# EasyEDA Pro project ProPrj_辉光管时钟V1.0_2025-10-09.epro, schematic 电源+控制部分

## Sheets
1 控制: Create Date: 2024-01-13; Page Name: 控制; Project Name: 辉光管时钟成品; Schematic Name: 电源+控制部分; Update Date: 2024-08-01; Company: 嘉立创EDA; Page Size: A4; Version: V1.0
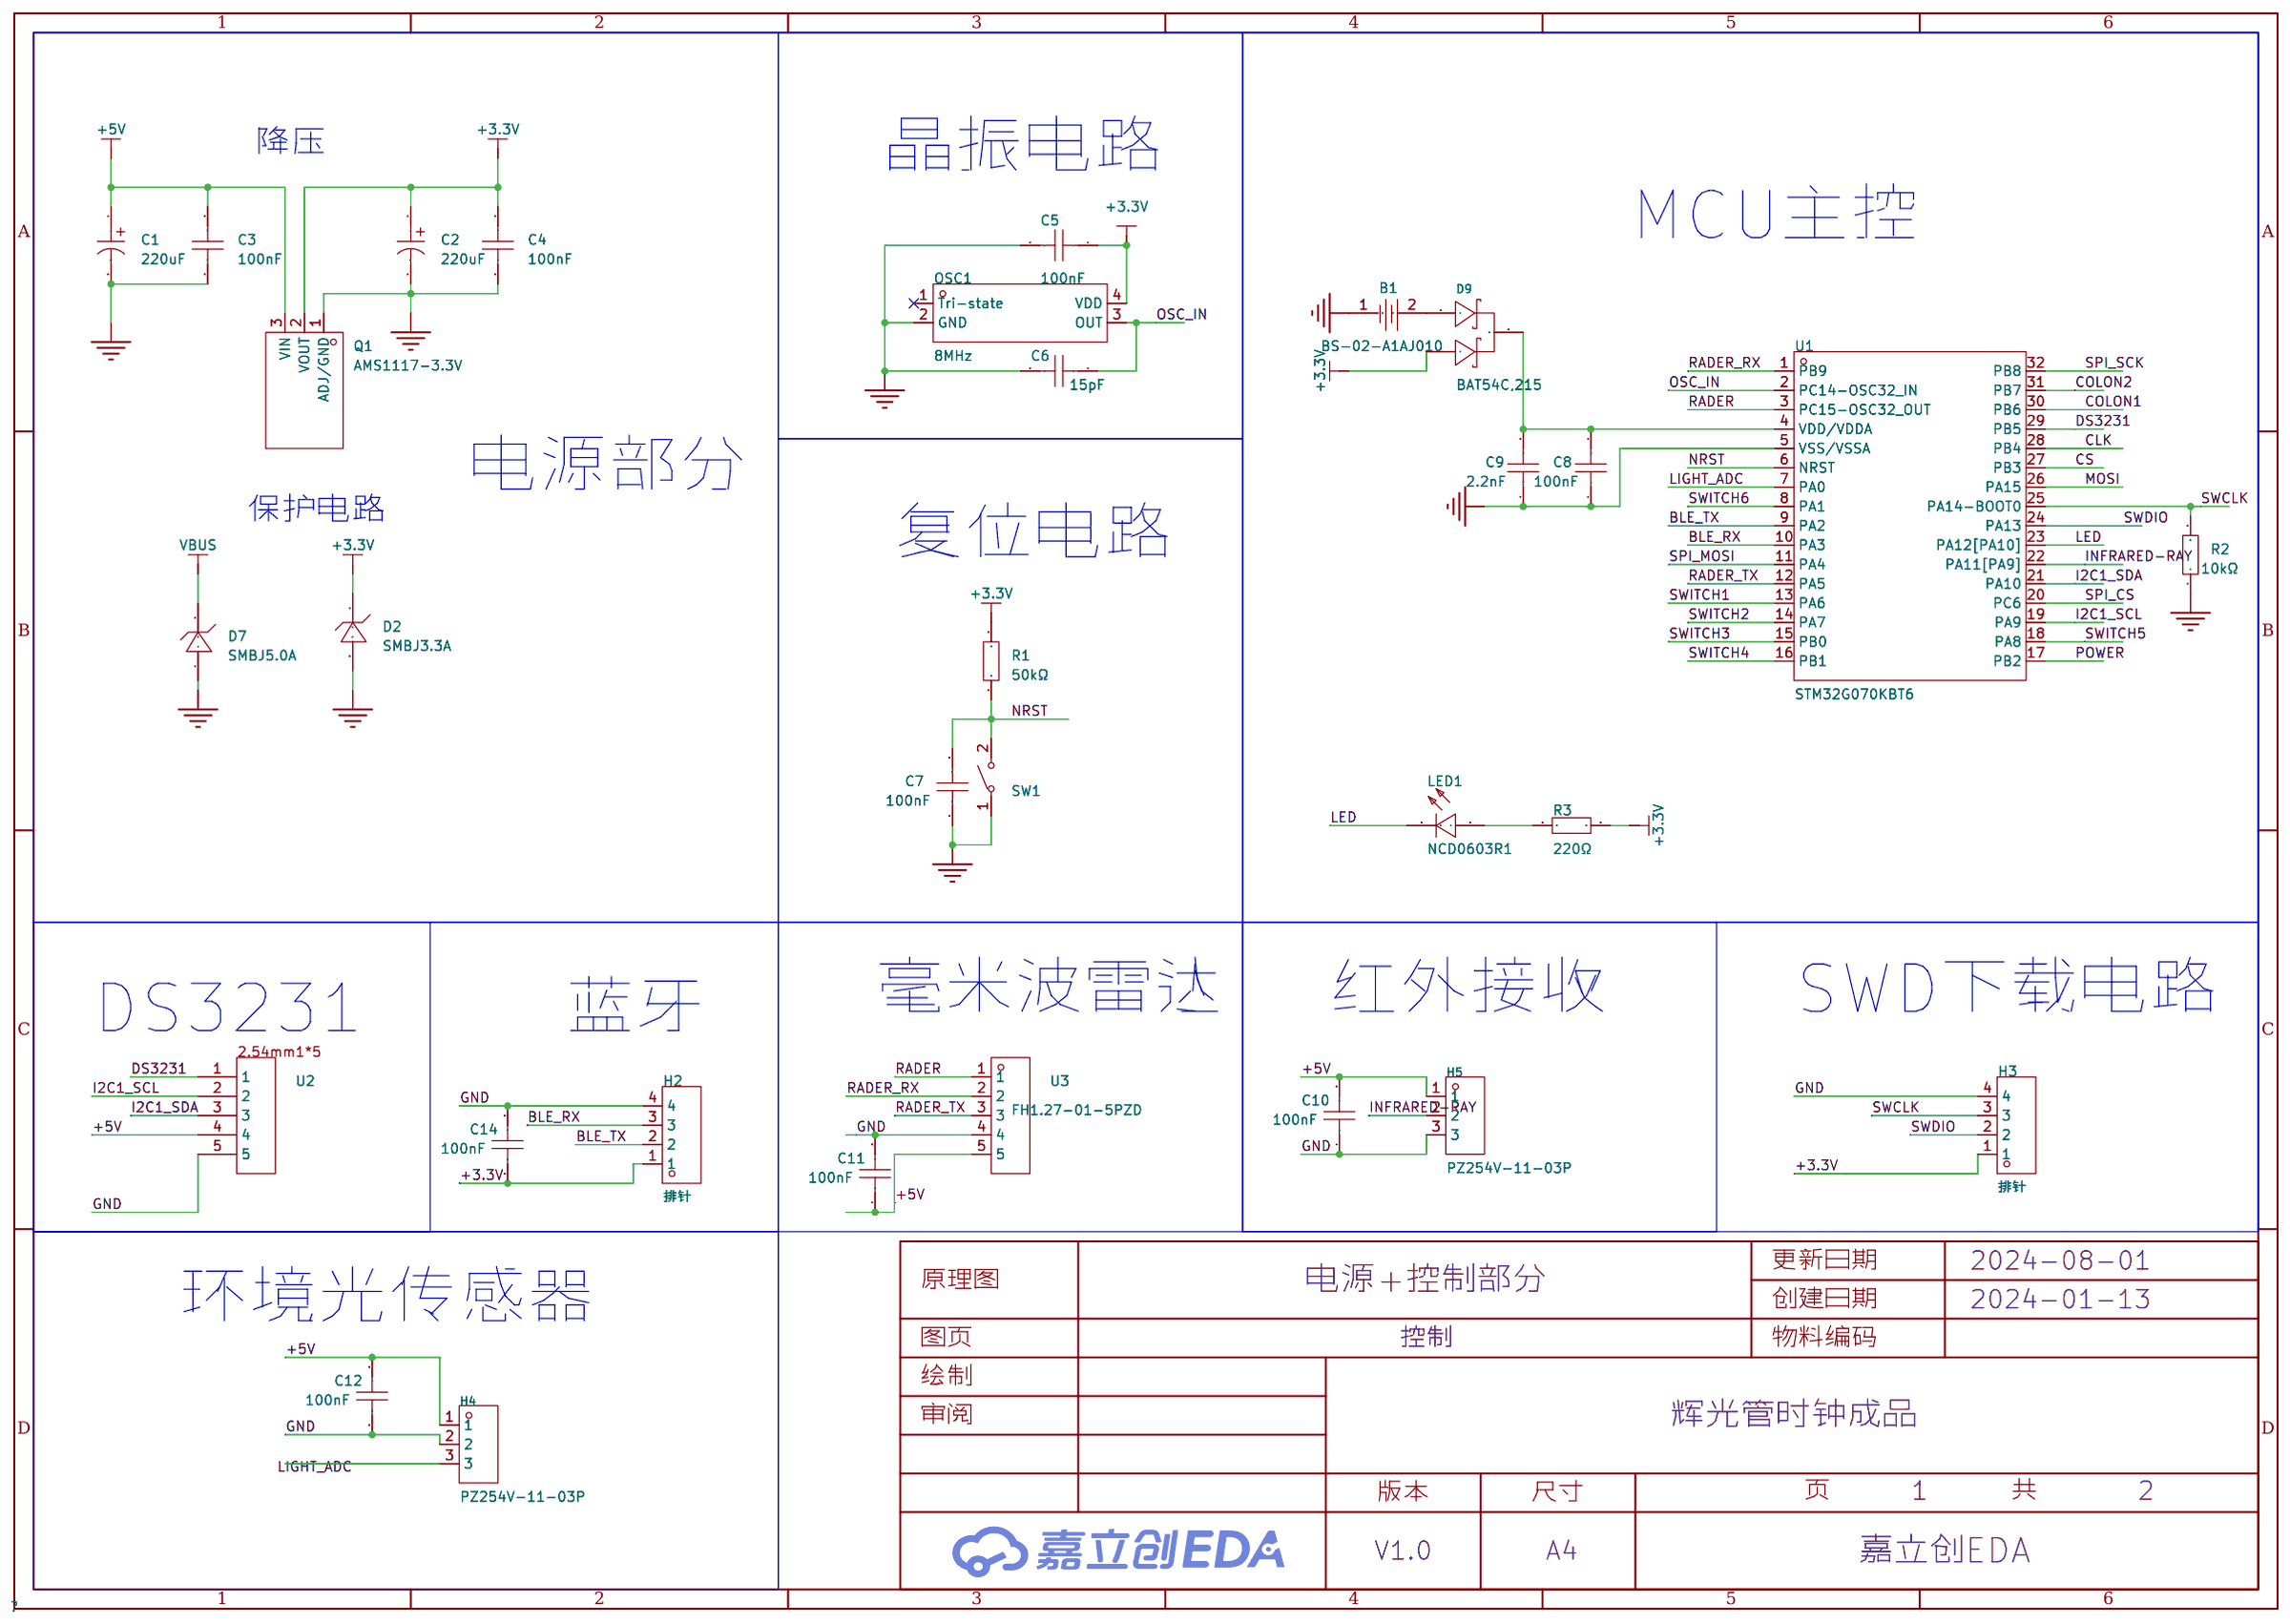
[diagram p1: 控制]
2 电源: Create Date: 2024-01-25; Page Name: 电源; Update Date: 2024-03-15; Page Size: A3
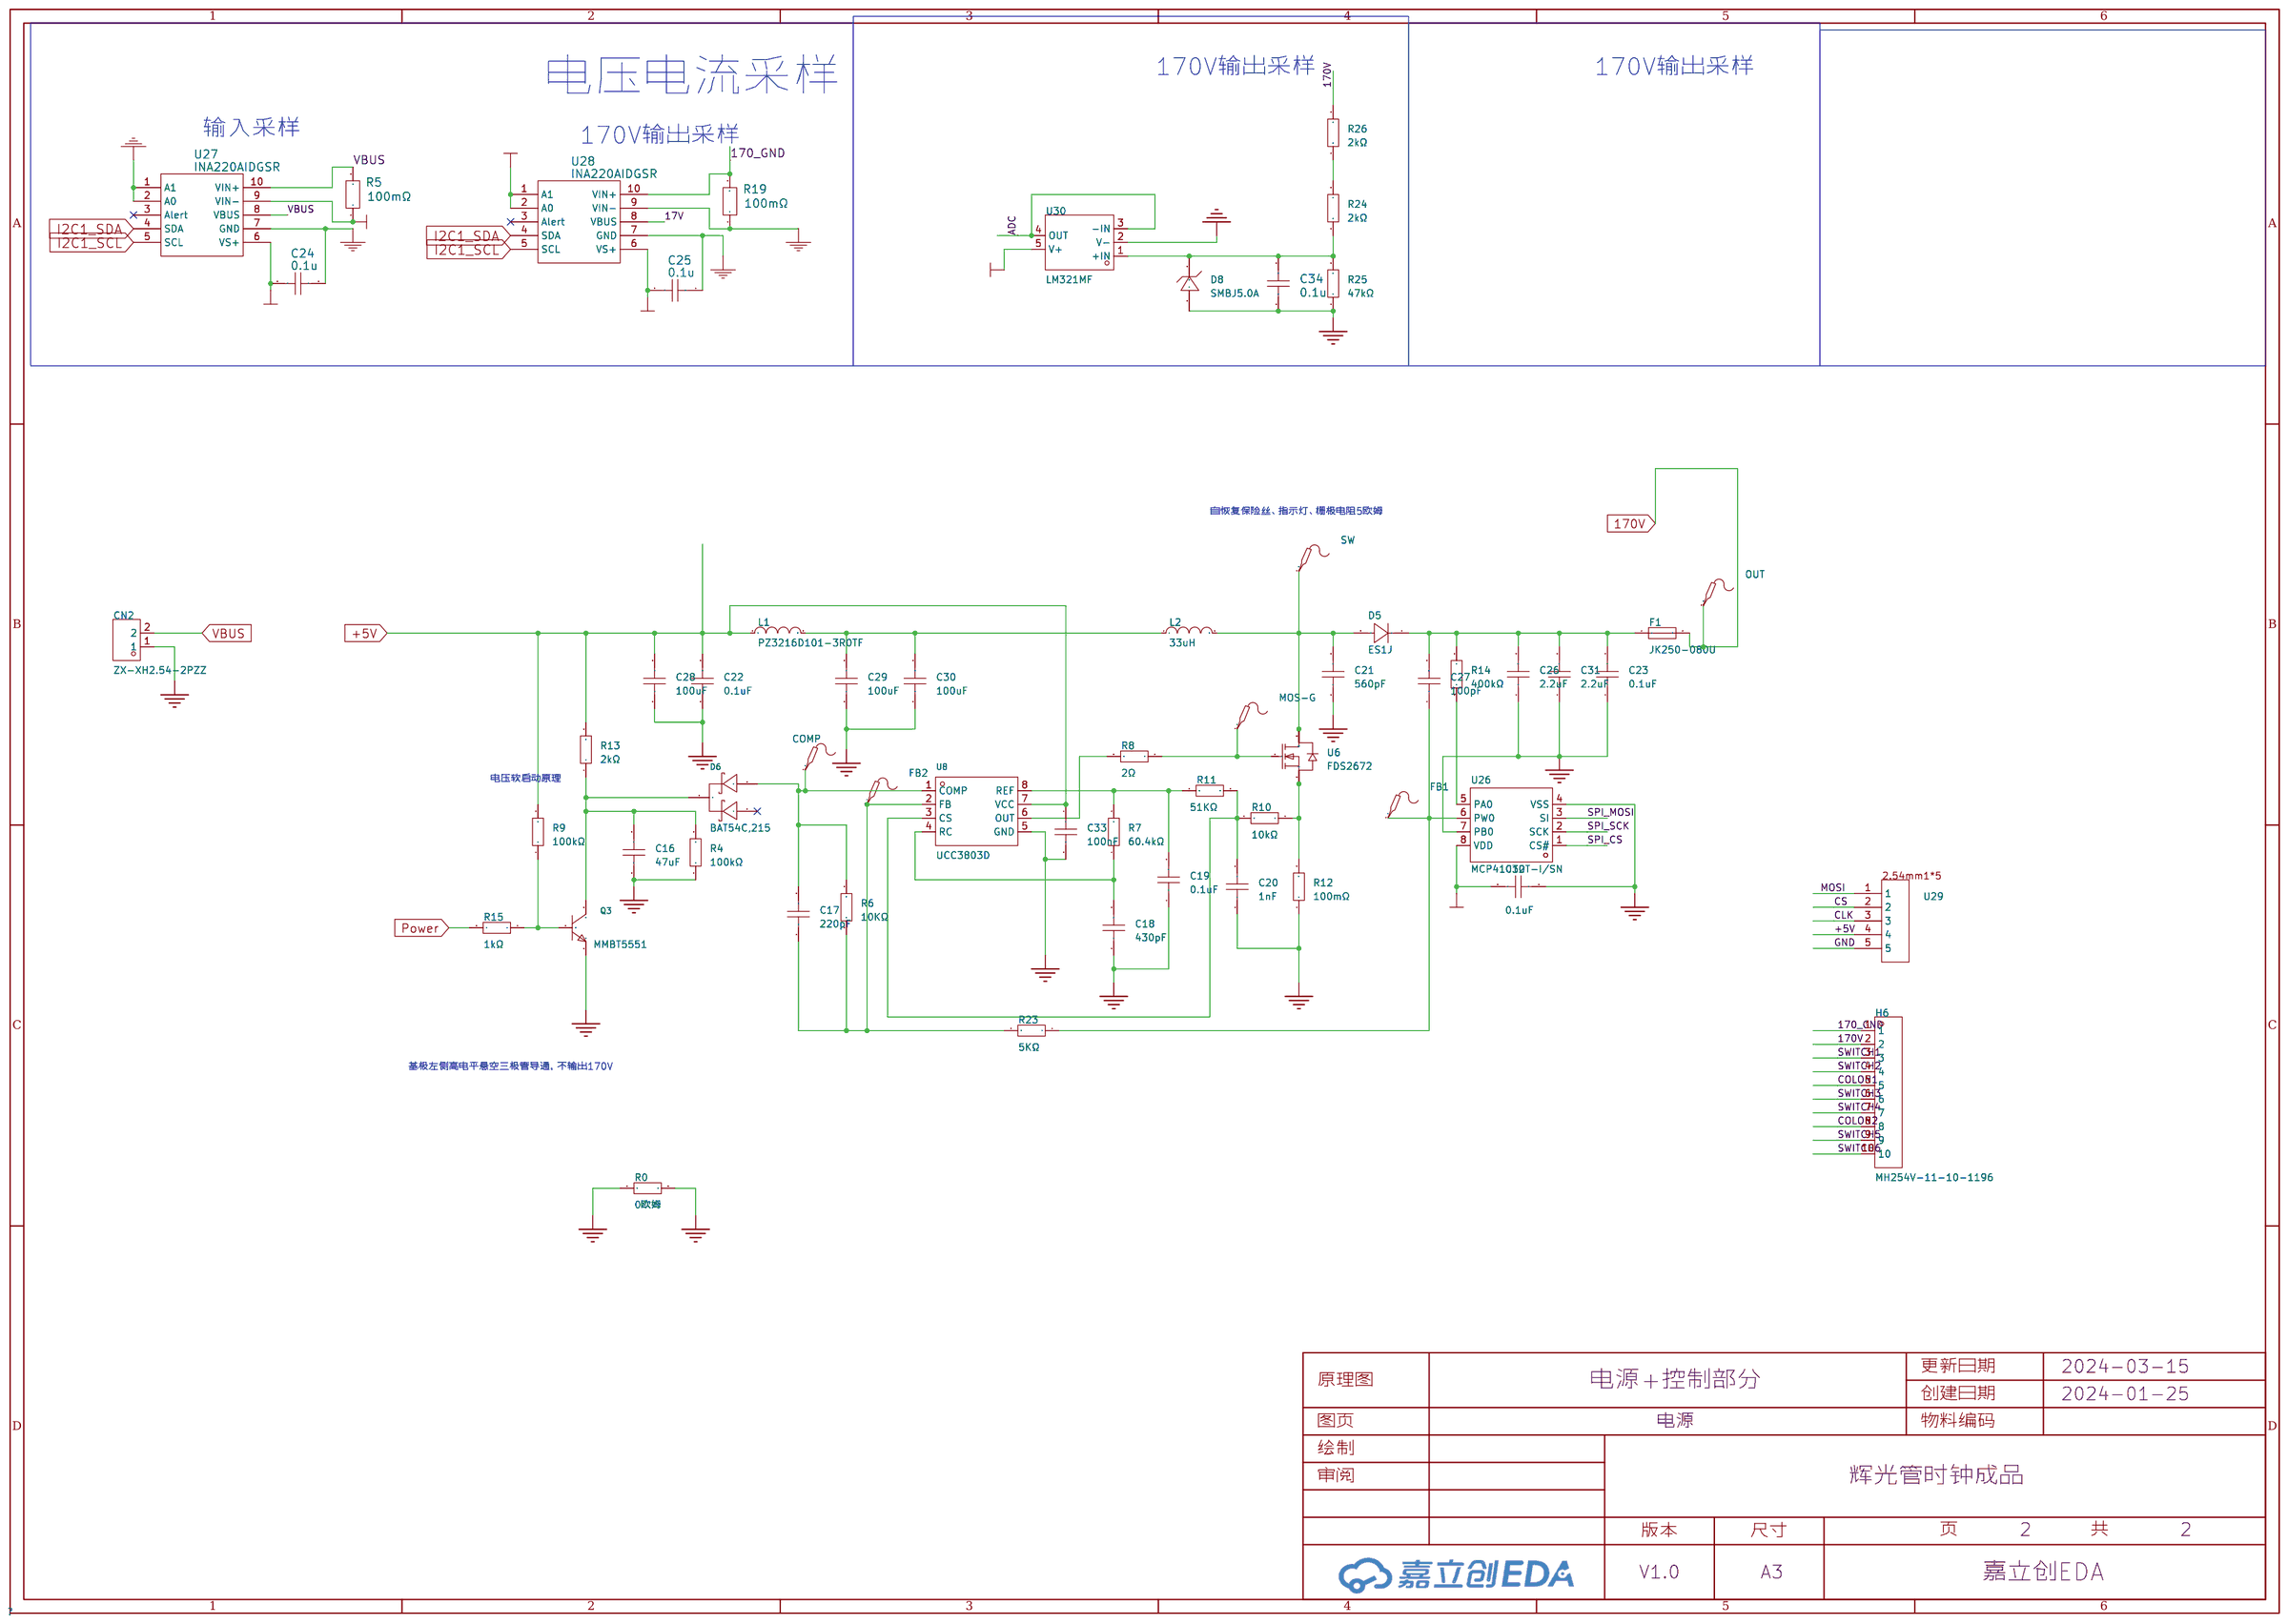
[diagram p2: 电源]

## Parts
sheet 控制
B1  BS-02-A1AJ010  [BAT-TH_BS-02-A1AJ010]
C1  220uF  [CAP-SMD_BD6.3-L6.6-W6.6-FD]
C2  220uF  [CAP-SMD_BD6.3-L6.6-W6.6-FD]
C3  100nF  [C0603]
C4  100nF  [C0603]
C5  100nF  [C0603]
C6  15pF  [C0603]
C7  100nF  [C0603]
C8  100nF  [C0603]
C9  2.2nF  [C0603]
C10  100nF  [C0603]
C11  100nF  [C0603]
C12  100nF  [C0603]
C14  100nF  [C0603]
D2  SMBJ3.3A  [SMB_L4.6-W3.6-LS5.3-RD]
D7  SMBJ5.0A  [SMB_L4.4-W3.6-LS5.3-RD]
D9  BAT54C,215  [SOT-23-3_L2.9-W1.6-P1.90-LS2.8-BR]
H2  排针  [SIP-2.54MM-4P-CJT-H8.54]
H3  排针  [SIP-2.54MM-4P-CJT-H8.54]
H4  PZ254V-11-03P  [HDR-TH_3P-P2.54-V-M]
H5  PZ254V-11-03P  [HDR-TH_3P-P2.54-V-M]
LED1  NCD0603R1  [LED0603-RD_RED]
OSC1  8MHz  [OSC-SMD_4P-L3.2-W2.5-BL-1]
Q1  AMS1117-3.3V  [SOT-89-3_L4.5-W2.5-P1.50-LS4.2-BR]
R1  50kΩ  [r0603]
R2  10kΩ  [r0603]
R3  220Ω  [r0603]
SW1  TS-1088R-02026  [SW-SMD_L3.9-W3.0-P4.45]
U1  STM32G070KBT6  [LQFP-32_L7.0-W7.0-P0.80-LS9.0-BL]
U2  -  [2.54mm1*5]
U3  FH1.27-01-5PZD  [HDR-TH_5P-P1.27-V-M]
sheet 电源
C16  47uF  [C0805]
C17  220pF  [c0603]
C18  430pF  [c0603]
C19  0.1uF  [c0603]
C20  1nF  [c0603]
C21  560pF  [c1206]
C22  0.1uF  [c0603]
C23  0.1uF  [c1206]
C24  0.1u  [C0603]
C25  0.1u  [C0603]
C26  2.2uF  [c1210]
C27  100pF  [C0805]
C28  100uF  [c1206]
C29  100uF  [c1206]
C30  100uF  [c1206]
C31  2.2uF  [c1210]
C32  0.1uF  [c0603]
C33  100nF  [C0603]
C34  0.1u  [C0603]
CN2  ZX-XH2.54-2PZZ  [CONN-TH_2P-P2.50_HX25003-2A]
COMP  -  [Test-Point-0.5mm]
D5  ES1J  [sod-123_l2.7-w1.6-ls3.6-rd]
D6  BAT54C,215  [SOT-23-3_L2.9-W1.6-P1.90-LS2.8-BR]
D8  SMBJ5.0A  [SMB_L4.4-W3.6-LS5.3-RD]
F1  JK250-080U  [FUSE-TH_L5.8-W3.8-P5.10-D0.8]
FB1  -  [Test-Point-0.5mm]
FB2  -  [Test-Point-0.5mm]
H6  MH254V-11-10-1196  [HDR-TH_10P-P2.54-V-M]
L1  10uH  [l0603]
L2  33uH  [33uh功率电感]
MOS-G  -  [Test-Point-0.5mm]
OUT  -  [Test-Point-0.5mm]
Q3  MMBT5551  [SOT-23-3_L2.9-W1.3-P1.90-LS2.4-BR]
R0  0欧姆  [R0603]
R4  100kΩ  [r0603]
R5  100mΩ  [R0805]
R6  10KΩ  [r0603]
R7  60.4kΩ  [r0603]
R8  2Ω  [r0603]
R9  100kΩ  [r0603]
R10  10kΩ  [r0603]
R11  51KΩ  [r0603]
R12  100mΩ  [R0805]
R13  2kΩ  [r0603]
R14  400kΩ  [r0603]
R15  1kΩ  [r0603]
R19  100mΩ  [R0805]
R23  5KΩ  [r0603]
R24  2kΩ  [r0603]
R25  47kΩ  [r0603]
R26  2kΩ  [r0603]
SW  -  [Test-Point-0.5mm]
U6  FDS2672  [SO-8_L4.9-W3.9-P1.27-LS6.0-BL]
U8  UCC3803D  [SOIC-8_L4.9-W3.9-P1.27-LS6.0-BL]
U26  MCP41010T-I/SN  [SOIC-8_L4.9-W3.9-P1.27-LS6.0-BL]
U27  INA220AIDGSR  [VSSOP-10_L3.0-W3.0-P0.50-LS4.9-BL]
U28  INA220AIDGSR  [VSSOP-10_L3.0-W3.0-P0.50-LS4.9-BL]
U29  -  [2.54mm1*5]
U30  LM321MF  [SOT-23-5_L2.9-W1.6-P0.95-LS2.8-BL]

## Library data of the parts
B1 = BS-02-A1AJ010: 连接器类型:电池底座;适用电池规格:CR2032;触头材质:磷青铜;触点电镀:镍;工作温度范围:-25℃~+85℃;; LCSC Part Name: 电池底座 适用电池:CR2032; Supplier Part: C5239862; Manufacturer: MYOUNG(美阳); Supplier Footprint: 插件; JLCPCB Part Class: 扩展库; Datasheet: https://atta.szlcsc.com/upload/public/pdf/source/20221102/8F00F2B23A2A3C447A59C327BBA6C743.pdf; Supplier: LCSC; Connector Type: 电池底座; Battery Type: CR2032; Contact Material: 磷青铜; Contact Plating: 镍; Operating Temperature Range: -25℃~+85℃
C1 C2 = RVT220UF10V67RV0037: 容值:220uF;精度:±20%;额定电压:10V;纹波电流:69mA@120Hz;等效串联电阻:-;; LCSC Part Name: 220uF ±20% 10V; Supplier Part: C2833309; Manufacturer: KNSCHA(科尼盛); Supplier Footprint: SMD,D6.3xL5.4mm; JLCPCB Part Class: Extended Part; Datasheet: https://atta.szlcsc.com/upload/public/pdf/source/20210521/C2833309_008BCE4BC4FC60DA08096FEE6338ABBD.pdf; Supplier: LCSC; Tolerance: ±20%; Rated Voltage: 10V; Ripple Current: 69mA@120Hz; φD: 6.3mm; L: 5.4mm; Lifetime @ Temp: 2000hrs@105℃; Operating Temperature: -55℃~+105℃
C3-C12 C14 = CC0603KRX7R9BB104: 容值:100nF;精度:±10%;额定电压:50V;材质(温度系数):X7R;; LCSC Part Name: 100nF ±10% 50V; Supplier Part: C14663; Manufacturer: YAGEO(国巨); Supplier Footprint: 0603; JLCPCB Part Class: Basic Part; Datasheet: https://atta.szlcsc.com/upload/public/pdf/source/20180910/C282072_33301C7F631E79921B82A8DAC6BCC5B3.pdf; Supplier: LCSC; Tolerance: ±10%; Voltage Rated: 50V; Temperature Coefficient: X7R
D2 = SMBJ3.3A_C362089: 反向截止电压(Vrwm):3.3V;击穿电压:4.1V;最大钳位电压:7.3V;; LCSC Part Name: 单向TVS 3.3V截止 600W峰值脉冲功率; Supplier Part: C362089; Manufacturer: JKSEMI(金开盛); Supplier Footprint: SMB(DO-214AA); JLCPCB Part Class: Extended Part; Datasheet: https://atta.szlcsc.com/upload/public/pdf/source/20200731/C362089_3B984BF84356FE4A5051ADB3F5B1E766.pdf; Supplier: LCSC; Unidirectional Channels: 1; Bidirectional Channels: 0; Reverse Stand-Off Voltage (Vrwm): 3.3V; Breakdown Voltage: 4.1V; Maximum Clamping Voltage: 7.3V; Peak Pulse Power Dissipation (Ppp)@10/1000us: 600W
D7 D8 = SMBJ5.0A_C726811: 极性：单向 反向截止电压(Vrwm)：5V 击穿电压：6.4V 最大钳位电压：9.2V; Supplier Part: C726811; Manufacturer: TWGMC(台湾迪嘉); Supplier Footprint: SMB; JLCPCB Part Class: Extended Part; Datasheet: https://atta.szlcsc.com/upload/public/pdf/source/20200901/C726811_07201DC3516E92FF13903A0BAE18F725.pdf; Supplier: LCSC
D6 D9 = BAT54C,215: 二极管配置:1对共阴极;直流反向耐压(Vr):30V;平均整流电流(Io):200mA;正向压降(Vf):800mV@100mA;; LCSC Part Name: 电压:30V 电流:200mA; Supplier Part: C37704; Manufacturer: Nexperia(安世); Supplier Footprint: SOT-23(TO-236); JLCPCB Part Class: Basic Part; Datasheet: https://atta.szlcsc.com/upload/public/pdf/source/20161024/1477288736847.pdf; Supplier: LCSC; Diode Configuration: 1对共阴极; Reverse Voltage (Vr): 30V; Average Rectified Current (Io): 200mA; Forward Voltage (Vf@If): 800mV@100mA; Reverse Leakage Current (Ir): 2uA@25V
H2 H3 = 排针
H4 H5 = PZ254V-11-03P: 排数:单排;总PIN位数:3;间距:2.54mm;插针结构:1x3P;行距:-;安装类型:直插;圆针/方针:方针;额定电流:3A;额定电压:250V;配合针长度:6mm;塑高:2.5mm;端接针长度:3mm;工作温度范围:-40℃~+105℃;颜色:黑色;; LCSC Part Name: 2.54mm 1x3P 直插 方针; Supplier Part: C2937625; Manufacturer: XFCN(兴飞); Supplier Footprint: 直插,P=2.54mm; JLCPCB Part Class: Extended Part; Datasheet: 2022-07-12/581362A/62b9d00620994b3696be7eb4af85ad72/双排排针和单排排针.pdf; Supplier: LCSC; Number of Rows: 单排; Number of Pins: 3; Pitch: 2.54mm; Pin Structure: 1x3P; Mounting Type: 直插; Circluar Pins/Square Pins: 方针; Current Rating (Max): 3A; Voltage Rating (Max): 250V; Length of Mating Pin: 6mm; Insulation Height: 2.5mm; Length of End Connection Pin: 3mm; Operating Temperature Range: -40℃~+105℃; Color: 黑色
LED1 = NCD0603R1_C84263: 发光颜色:红色;功率:65mW;透镜颜色:无色透明;主波长:615nm~630nm;发光强度:80mcd~220mcd;发光角度:130°;工作温度:-30℃~+85℃;; LCSC Part Name: 红灯 0603红灯   正贴; Supplier Part: C84263; Manufacturer: 国星光电; Supplier Footprint: 0603; JLCPCB Part Class: 扩展库; Datasheet: https://atta.szlcsc.com/upload/public/pdf/source/20200820/C84263_DABC6A75E58F576973B407FDBA283D60.pdf; Supplier: LCSC; Emitted Color: 红色; Forward Voltage (VF): 1.6V~2.6V; Forward Current: 20mA; Power Dissipation: 65mW; Lens Color: 无色透明; Dominant Wavelength: 615nm~630nm; Luminous Intensity: 80mcd~220mcd; Viewing Angle: 130°; Operating Temperature: -30℃~+85℃
OSC1 = OT2EL4C4JI-111OLP-8M: 频率:8MHz;工作电压:1.8V~3.3V;; LCSC Part Name: 8MHZ?1.8V-3.3V?±10PPM YSO110TR; Supplier Part: C5189450; Manufacturer: YXC(扬兴晶振); Supplier Footprint: SMD3225-4P; JLCPCB Part Class: 扩展库; Datasheet: https://atta.szlcsc.com/upload/public/pdf/source/20221009/1148DEA51132416CC556CBB25766F9C8.pdf; Supplier: LCSC; Supply Voltage: 1.8V~3.3V; Operating Temperature: -40℃~+85℃
Q1 = AMS1117-3.3V_C5120796: 输出类型:固定;最大输入电压:18V;输出电压:3.3V;最大输出电流:1A;输出极性:正极;; LCSC Part Name: 输入18V 输出3.3V 1A; Supplier Part: C5120796; Manufacturer: MSKSEMI(美森科); Supplier Footprint: SOT-89; JLCPCB Part Class: Extended Part; Datasheet: https://atta.szlcsc.com/upload/public/pdf/source/20231123/6117526697EB8BF6175FDEEBA0877266.pdf; Supplier: LCSC; Output Type: 固定; Maximum Input Voltage: 18V; Output Voltage: 3.3V; MAX Output Current: 1A; Dropout Voltage: 1.4V@(1A); standby current: 12mA; Operating Temperature: 0℃~+125℃; Output Polarity: 正极; Number of Outputs: 1
R1-R4 R6-R11 R13-R15 R23-R26 = 0805W8F1002T5E_C17414: 电阻类型:厚膜电阻;阻值:10kΩ;精度:±1%;功率:125mW;; LCSC Part Name: 10kΩ ±1% 125mW; Supplier Part: C17414; Manufacturer: UNI-ROYAL(厚声); Manufacturer Part: 0805W8F1002T5E; Supplier Footprint: 0805; JLCPCB Part Class: Basic Part; Datasheet: https://atta.szlcsc.com/upload/public/pdf/source/20200306/C422600_1E6D84923E4A46A82E41ADD87F860B5C.pdf; Supplier: LCSC; Type: 厚膜电阻; Tolerance: ±1%; Power(Watts): 125mW; Temperature Coefficient: ±100ppm/℃; Overload Voltage (Max): 150V; Operating Temperature Range: -55℃~+155℃
SW1 = TS-1088R-02026: 电路结构:单刀单掷;按钮形状:圆形按钮;开关长度:3.9mm;开关宽度:2.93mm;开关高度:2mm;触点电流:50mA;额定电压(DC):12V;安装方式:立贴;带灯:-;机械寿命:-;; LCSC Part Name: 3.9*2.93*2mm 立贴 轻触开关; Supplier Part: C455280; Manufacturer: XUNPU(讯普); Supplier Footprint: SMD,3x4mm; JLCPCB Part Class: 扩展库; Datasheet: https://atta.szlcsc.com/upload/public/pdf/source/20191118/C455281_EC5379764BC1462550DF64BBBFEA9579.pdf; Supplier: LCSC; Circuit: 单刀单掷; Actuator Style: 圆形按钮; Switch Length: 3.9mm; Switch Width: 2.93mm; Switch Height: 2mm; Contact Current: 50mA; Voltage Rating (DC): 12V; Mounting Style: 立贴
U1 = STM32G070KBT6: CPU内核:ARM Cortex-M0;CPU最大主频:64MHz;工作电压范围:2V~3.6V;程序存储容量:128KB;程序存储器类型:FLASH;RAM总容量:36KB;GPIO端口数量:29;; Supplier Part: C529339; Manufacturer: ST(意法半导体); Supplier Footprint: LQFP-32(7x7); JLCPCB Part Class: 扩展库; Datasheet: https://atta.szlcsc.com/upload/public/pdf/source/20200511/C529338_48C8B1D333BC51E6E9668757AAD26A84.pdf; Supplier: LCSC; CPU Core: ARM Cortex-M0; CPU Maximum Speed: 64MHz; Operating Voltage Range: 2V~3.6V; Program Storage Size: 128KB; Program Memory Type: FLASH; RAM Size: 36KB; GPIO Ports Number: 29; ADC (Bit): 12bit; Peripheral/Function: DMA；PWM; Internal Oscillator: 有; Operating Temperature Range: -40℃~+85℃
U2 U29 = 2.54mm1*5
U3 = FH1.27-01-5PZD: 插针结构:1x5P;间距:1.27mm;安装方式:直插;总PIN数:5P;排数:1;每排PIN数:5;额定电流:1A;触头材质:磷青铜;工作温度范围:-40℃~+105℃;; LCSC Part Name: 1x5P 间距:1.27mm 直插; Supplier Part: C7500807; Manufacturer: XUNPU(讯普); Supplier Footprint: 插件,P=1.27mm; Datasheet: https://atta.szlcsc.com/upload/public/pdf/source/20230809/1C0A5A5FA3077CCA4BCC60F929FB990D.pdf; Supplier: LCSC; Pins Structure: 1x5P; Pitch: 1.27mm; Mounting Style: 直插; Number of Pins: 5P; Number of Rows: 1; Number of PINs Per Row: 5; Current Rating (Max): 1A; Contact Material: 磷青铜; Operating Temperature Range: -40℃~+105℃
C16-C20 C22 C23 C27-C30 C32 = CC0805KRX7R9BB104: 容值:100nF;精度:±10%;额定电压:50V;材质(温度系数):X7R;; LCSC Part Name: 100nF ±10% 50V; Supplier Part: C49678; Manufacturer: YAGEO(国巨); Supplier Footprint: 0805; JLCPCB Part Class: Basic Part; Datasheet: https://atta.szlcsc.com/upload/public/pdf/source/20151026/1457707504898.pdf; Supplier: LCSC; Tolerance: ±10%; Voltage Rated: 50V; Temperature Coefficient: X7R
C21 = CC0805KRX7R9BB104: 容值:100nF;精度:±10%;额定电压:50V;材质(温度系数):X7R;; LCSC Part Name: 100nF ±10% 50V; Supplier Part: C49678; Manufacturer: YAGEO(国巨); Supplier Footprint: 1206; JLCPCB Part Class: Basic Part; Datasheet: https://atta.szlcsc.com/upload/public/pdf/source/20151026/1457707504898.pdf; Supplier: LCSC; Tolerance: ±10%; Voltage Rated: 50V; Temperature Coefficient: X7R
C24 C25 C34 = 0.1u
C26 C31 = CC0805KRX7R9BB104: 容值:100nF;精度:±10%;额定电压:50V;材质(温度系数):X7R;; LCSC Part Name: 100nF ±10% 50V; Supplier Part: C49678; Manufacturer: YAGEO(国巨); Supplier Footprint: 0805; JLCPCB Part Class: Basic Part; Datasheet: https://atta.szlcsc.com/upload/public/pdf/source/20151026/1457707504898.pdf; Supplier: LCSC; Tolerance: ±10%; Voltage Rated: 200V; Temperature Coefficient: X7R
C33 = CAP_0603: Supplier Footprint: 0603
CN2 = ZX-XH2.54-2PZZ: 插针结构:1x2P;间距:2.54mm;安装方式:直插;参考系列:XH;总PIN数:2P;排数:1;每排PIN数:2;行距:-;额定电流:3A;触头材质:黄铜;触头镀层:锡;工作温度范围:-25℃~+85℃;; Supplier Part: C7429632; Manufacturer: Megastar(兆星); Supplier Footprint: 插件,P=2.54mm; JLCPCB Part Class: Extended Part; Datasheet: https://atta.szlcsc.com/upload/public/pdf/source/20230619/19BA6947230AA44A04D3EDD65E618FD0.pdf; Supplier: LCSC; Pins Structure: 1x2P; Pitch: 2.54mm; Mounting Style: 直插; Reference Series: XH; Number of Pins: 2P; Number of Rows: 1; Number of PINs Per Row: 2; Current Rating (Max): 3A; Contact Material: 黄铜; Contact Plating: 锡; Operating Temperature Range: -25℃~+85℃
COMP FB1 FB2 MOS-G OUT SW = Test-Point: Test Point 测试点
D5 = ES1J_C691230: 正向压降(Vf):1.3V @ 1A;平均整流电流(Io):1A;直流反向耐压(Vr):600V;二极管配置:独立式;工作结温(Tj):-55℃~+150℃;工作结温(Tj):-55℃~+150℃;反向电流(Ir):5uA @ 600V;反向恢复时间(trr):35ns;; Supplier Part: C691230; Manufacturer: DIODES(美台); Supplier Footprint: SMA; JLCPCB Part Class: Extended Part; Datasheet: https://atta.szlcsc.com/upload/public/pdf/source/20200628/C691230_6EC9ACEA5CE84292BBF501D48DE20532.pdf; Supplier: LCSC
F1 = JK250-080U: 最大电压:250V;最大电流:3A;保持电流:80mA;跳闸电流:160mA;; LCSC Part Name: 250V 80mA 插件自恢复; Supplier Part: C369127; Manufacturer: JK(金科); Supplier Footprint: 插件; JLCPCB Part Class: Extended Part; Datasheet: https://atta.szlcsc.com/upload/public/pdf/source/20190402/C369127_E7230E1328F96C53474DAC88A9C5A944.pdf; Supplier: LCSC; Operating Voltage (Max): 250V; Current Rating (Max): 3A; Hold Current: 80mA; Trip Current: 160mA; Maximum Time to Trip: 500ms
H6 = MH254V-11-10-1196: LCSC Part Name: 圆孔排针2.54mm 1x10P 直插 镀金1U L=11.96mm 常规型; Supplier Part: C5184055; Manufacturer: XFCN(兴飞); Supplier Footprint: 插件,P=2.54mm; JLCPCB Part Class: 扩展库; Datasheet: https://atta.szlcsc.com/upload/public/pdf/source/20220929/9F034EF7D5273C93A87A714F13A4BC8E.pdf; Supplier: LCSC
L1 = PZ3216D101-3R0TF: 标称阻抗@测试频率:100Ω@100MHz;误差:±25%;直流电阻(RDC):-;; LCSC Part Name: 单路 1206磁珠 阻抗100Ω@100MHz; Supplier Part: C370089; Manufacturer: Sunlord(顺络); Supplier Footprint: 1206; JLCPCB Part Class: Extended Part; Datasheet: https://atta.szlcsc.com/upload/public/pdf/source/20210816/2FE48A83668C9496AD98DE44B7F0FA96.pdf; Supplier: LCSC; Impedance @ Frequency: 100Ω@100MHz; Tolerance: ±25%; Current Rating: 3A; Circuits: 1
L2 = CXP0630-330M-AG(33uh): 类型:一体成型电感;电感值:33uH;精度:±20%;额定电流:2A;饱和电流(Isat):2.5A;; LCSC Part Name: 33uH ±20% 2.5A; Supplier Part: C7461364; Manufacturer: DMBJ(振宝佳); Supplier Footprint: 0630; Datasheet: https://atta.szlcsc.com/upload/public/pdf/source/20230706/7F3A5B39C5AD80A91C9FA782B54A296B.pdf; Supplier: LCSC; Type: 一体成型电感; Tolerance: ±20%; Rated Current: 2A; Saturation Current (Isat): 2.5A; DC Resistance (DCR): 240mΩ
Q3 = MMBT5551_C2145: 晶体管类型:NPN;集射极击穿电压(Vceo):160V;集电极电流(Ic):600mA;功率(Pd):300mW;直流电流增益(hFE@Ic,Vce):200@10mA,5V;; LCSC Part Name: NPN 160V 600mA G1 H档200-300; Supplier Part: C2145; Manufacturer: CJ(江苏长电/长晶); Supplier Footprint: SOT-23; JLCPCB Part Class: Basic Part; Datasheet: https://atta.szlcsc.com/upload/public/pdf/source/20140809/1457707209203.pdf; Supplier: LCSC; Transistor Type: NPN; Collector-Emitter Breakdown Voltage (Vceo): 160V; Collector Current (Ic): 600mA; Power Dissipation (Pd): 300mW; Collector Cut-Off Current (Icbo): 50nA; Collector-Emitter Saturation Voltage (VCE(sat)@Ic,Ib): 200mV@50mA,5mA; DC Current Gain (hFE@Ic,Vce): 200@10mA,5V; Transition Frequency (fT): 100MHz; Operating Temperature: +150℃@(Tj)
R0 = Res_0603: Supplier Footprint: 0603
R5 R19 = 5mΩ
R12 = RL10FTNR160: 阻值:160mΩ;精度:±1%;; LCSC Part Name: 160mΩ ±1%; Supplier Part: C5138985; Manufacturer: 大毅科技; Supplier Footprint: 0805; JLCPCB Part Class: Extended Part; Datasheet: https://atta.szlcsc.com/upload/public/pdf/source/20220824/9B3755BD17A966410CFA156DB04E8A1C.pdf; Supplier: LCSC; Tolerance: ±1%; Type: 厚膜电阻; Power(Watts): 125mW; Temperature Coefficient: ±100ppm/℃; Overload Voltage (Max): 150V; Operating Temperature Range: -55℃~+155℃
U6 = FDS2672: 类型:N沟道;漏源电压(Vdss):200V;连续漏极电流(Id):3.9A;功率(Pd):2.5W;导通电阻(RDS(on)@Vgs,Id):70mΩ@10V,3.9A;; LCSC Part Name: N沟道 200V 3.9A N 沟道，UltraFET Trench MOSFET，200V，3.9A，70mΩ; Supplier Part: C463724; Manufacturer: onsemi(安森美); Supplier Footprint: SO-8; JLCPCB Part Class: Extended Part; Datasheet: https://atta.szlcsc.com/upload/public/pdf/source/20221020/30635B57EECFDD9AF98E52E6F77A9868.pdf; Supplier: LCSC; Type: N沟道; Drain Source Voltage (Vdss): 200V; Continuous Drain Current (Id): 3.9A; Power Dissipation (Pd): 2.5W; Drain Source On Resistance (RDS(on)@Vgs,Id): 70mΩ@10V,3.9A; Gate Threshold Voltage (Vgs(th)@Id): 4V@250uA; Total Gate Charge (Qg@Vgs): 46nC@10V; Input Capacitance (Ciss@Vds): 2.535nF@100V; Operating Temperature: -55℃~+150℃@(Tj)
U8 = UCC3803D: 功能类型:升压型；降压型；升降压型;输出通道数:1;输入电压:3.6V~12V;开关频率:31kHz;; Supplier Part: C701477; Manufacturer: TI(德州仪器); Supplier Footprint: SOP-8; JLCPCB Part Class: Extended Part; Datasheet: https://www.ti.com/cn/lit/gpn/ucc3800; Supplier: LCSC; Function: 升压型；降压型；升降压型; Number of Outputs: 1; Input Voltage: 3.6V~12V; Synchronous Rectification: 否; Topology: 反激式；降压式；正激式；升压式; Switching Frequency: 31kHz; Duty Cycle (Max): 99%; Operating Temperature: 0℃~+70℃@(TA)
U26 = MCP41010T-I/SN: 供电电压:2.7V~5.5V;电阻值(欧姆):10kΩ;精度:±20%;接口类型:SPI;; Supplier Part: C136395; Manufacturer: MICROCHIP(美国微芯); Supplier Footprint: SOP-8; JLCPCB Part Class: Extended Part; Datasheet: https://atta.szlcsc.com/upload/public/pdf/source/20220205/C2666606_C5E8E7A5F3891B321C1555D845654E7B.pdf; Supplier: LCSC; Supply Voltage: 2.7V~5.5V; Resistance Value (Ohms): 10kΩ; Number of Taps: 256; Temperature Coefficient (Typ): 800ppm/℃; Precision: ±20%; Number of Channels: 1; Interface Type: SPI; Operating Temperature: -40℃~+85℃
U27 U28 = INA220AIDGSR: INA220 26V、双向、零漂移、低侧/高侧、I2C 输出电流/功率监控器; Supplier Part: C543040; Manufacturer: TI(德州仪器); Supplier Footprint: VSSOP-10-0.5mm; JLCPCB Part Class: Extended Part; Datasheet: https://www.ti.com/cn/lit/gpn/ina220; Supplier: LCSC; image: //image.lceda.cn/szlcsc/C49851.jpg
U30 = LM321MF: 放大器数:-;; Supplier Part: C668208; Manufacturer: UMW(友台半导体); Supplier Footprint: SOT-23-5L; JLCPCB Part Class: 扩展库; Datasheet: https://atta.szlcsc.com/upload/public/pdf/source/20231109/E49D74FC1833823153F9A4939CD7E005.pdf; Supplier: LCSC

## Nets
17V: U28.8(VBUS)
170V: F1.2 H6.2 OUT.1 R26.2
+3.3V: C2.1 C4.2 C5.1 C14.1 D2.1 D9.1(A) H2.1 H3.1 OSC1.4(VDD) Q1.2(VOUT) R1.2 R3.1
+5V: C1.1 C3.2 C10.2 C11.1 C12.2 C22.2 C24.2 C25.2 C28.2 C32.2 C33.1 H4.1 H5.1 L1.1 Q1.3(VIN) R5.1 R9.2 R13.2 U2.4 U3.5 U8.7(VCC) U26.8(VDD) U27.6(VS+) U27.9(VIN-) U28.1(A1) U28.2(A0) U28.6(VS+) U29.4 U30.5(V+)
GND: B1.1 C2.2 C4.1 C5.2 C6.2 C7.1 C8.1 C9.1 C10.1 C11.2 C12.1 C14.2 C18.1 C19.1 C24.1 C32.1 C33.2 D2.2 H2.4 H3.4 H4.2 H5.3 OSC1.2(GND) Q1.1(ADJ/GND) R0.2 R2.1 SW1.1 U1.5(VSS/VSSA) U2.5 U3.4 U8.5(GND) U26.4(VSS) U27.1(A1) U27.2(A0) U27.7(GND) U29.5 U30.2(V-)
PGND: C1.2 C3.1 C16.1 C20.1 C21.1 C22.1 C23.1 C25.1 C26.1 C28.1 C29.1 C30.1 C31.1 C34.2 CN2.1 D7.2(A) D8.2(A) Q3.2(E) R0.1 R4.1 R12.1 R19.1 R25.1 U26.7(PB0) U28.7(GND) U28.9(VIN-)
VBUS: CN2.2 D7.1(C) R5.2 U27.8(VBUS) U27.10(VIN+)
170_GND: H6.1 R19.2 U28.10(VIN+)
ADC: U30.3(-IN) U30.4(OUT)
BLE_RX: H2.3 U1.10(PA3)
BLE_TX: H2.2 U1.9(PA2)
CLK: U1.28(PB4) U29.3
COLON1: H6.5 U1.30(PB6)
COLON2: H6.8 U1.31(PB7)
CS: U1.27(PB3) U29.2
DS3231: U1.29(PB5) U2.1
I2C1_SCL: U1.19(PA9) U2.2 U27.5(SCL) U28.5(SCL)
I2C1_SDA: U1.21(PA10) U2.3 U27.4(SDA) U28.4(SDA)
INFRARED-RAY: H5.2 U1.22(PA11[PA9])
LED: LED1.1(K) U1.23(PA12[PA10])
LIGHT_ADC: H4.3 U1.7(PA0)
MOSI: U1.26(PA15) U29.1
NRST: C7.2 R1.1 SW1.2 U1.6(NRST)
OSC_IN: C6.1 OSC1.3(OUT) U1.2(PC14-OSC32_IN)
POWER: U1.17(PB2)
Power: R15.2
RADER: U1.3(PC15-OSC32_OUT) U3.1
RADER_RX: U1.1(PB9) U3.2
RADER_TX: U1.12(PA5) U3.3
SPI_CS: U1.20(PC6) U26.1(CS#)
SPI_MOSI: U1.11(PA4) U26.3(SI)
SPI_SCK: U1.32(PB8) U26.2(SCK)
SWCLK: H3.3 R2.2 U1.25(PA14-BOOT0)
SWDIO: H3.2 U1.24(PA13)
SWITCH1: H6.3 U1.13(PA6)
SWITCH2: H6.4 U1.14(PA7)
SWITCH3: H6.6 U1.15(PB0)
SWITCH4: H6.7 U1.16(PB1)
SWITCH5: H6.9 U1.18(PA8)
SWITCH6: H6.10 U1.8(PA1)
$1N3438: LED1.2(A) R3.2
$3N2608: Q3.1(B) R9.1 R15.1
$3N2615: C18.2 R7.1 U8.4(RC)
$3N2617: MOS-G.1 R8.1 U6.4(G)
$3N2618: R8.2 U8.6(OUT)
$3N2620: C21.2 D5.2(A) L2.2 SW.1 U6.5(D) U6.6(D) U6.7(D) U6.8(D)
$3N2623: R10.1 R12.2 U6.1(S) U6.2(S) U6.3(S)
$3N2624: C20.2 R10.2 R11.1 U8.3(CS)
$3N2625: C19.2 R7.2 R11.2 U8.8(REF)
$3N2628: C16.2 D6.3(K) Q3.3(C) R4.2 R13.1
$3N2629: C17.2 COMP.1 D6.1(A) R6.2 U8.1(COMP)
$3N2630: C29.2 C30.2 L1.2 L2.1
$3N2637: C23.2 C26.2 C27.2 C31.2 D5.1(K) F1.1 R14.2
$3N2638: C17.1 FB2.1 R6.1 R23.2 U8.2(FB)
$3N2640: R14.1 U26.5(PA0)
$3N2641: C27.1 FB1.1 R23.1 U26.6(PW0)
Net-(B1-2): B1.2 D9.2(A)
Net-(C8-2): C8.2 C9.2 D9.3(K) U1.4(VDD/VDDA)
Net-(C34-1): C34.1 D8.1(C) R24.1 R25.2 U30.1(+IN)
Net-(R24-2): R24.2 R26.1

Not connected (* = marked no-connect by the designer): D6 2(A)*; OSC1 1(Tri-state)*; U27 3(Alert)*; U28 3(Alert)*

## Notes on the sheets
sheet 1
- 降压
- 晶振电路
- MCU主控
- 电源部分
- 保护电路
- 复位电路
- 毫米波雷达
- 红外接收
- SWD下载电路
- DS3231
- 蓝牙
- 环境光传感器
sheet 2
- 170V输出采样
- 170V输出采样
- 电压电流采样
- 输入采样
- 170V输出采样
- 自恢复保险丝、指示灯、栅极电阻5欧姆
- 电压软启动原理
- 基极左侧高电平悬空三极管导通，不输出170V
